# EAGLE design Power Distribution Board (EAGLE 6.6.0)
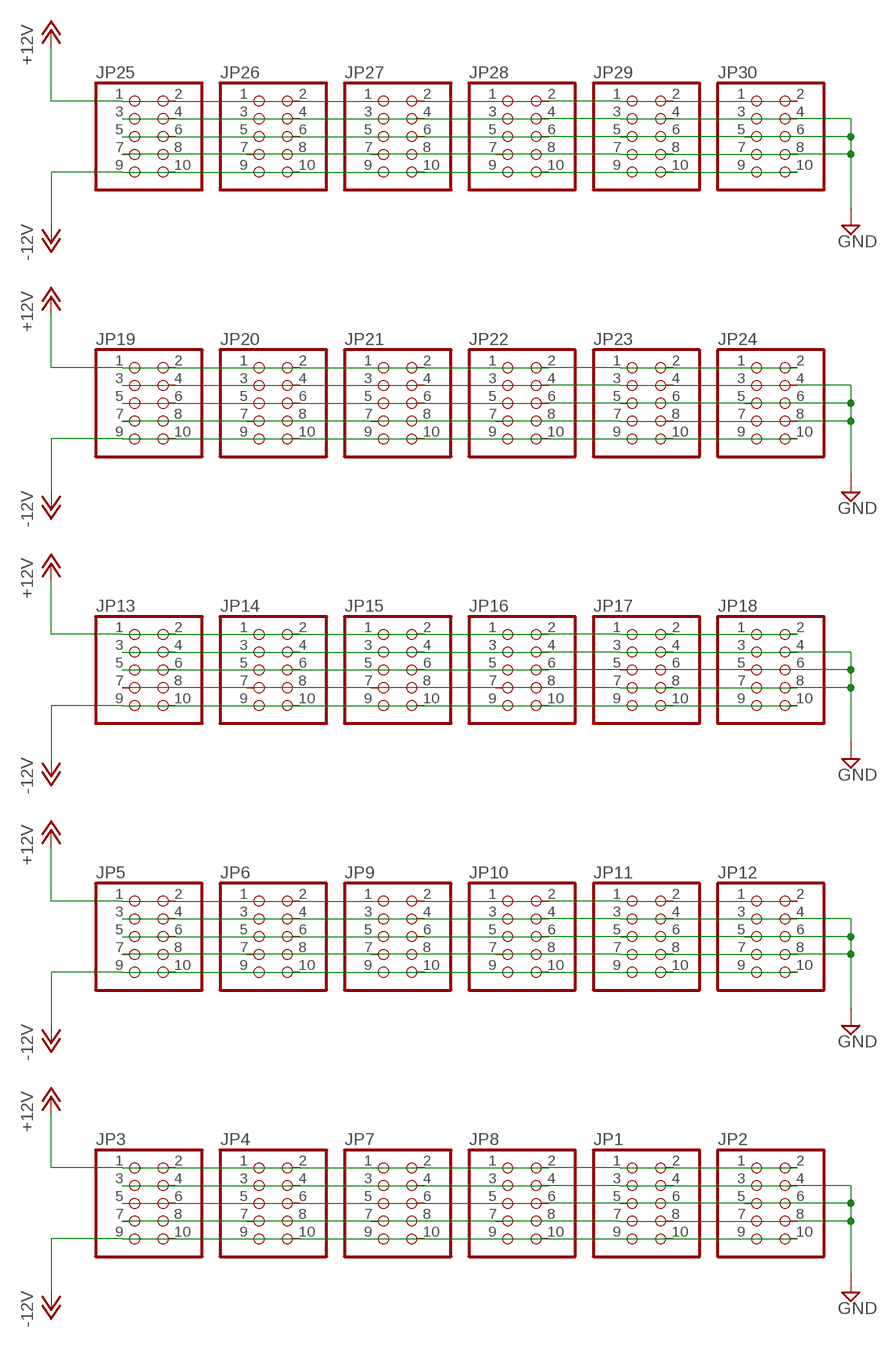
[diagram p0: schematic, sheet 1]

## Parts
JP1  PINHD-2X5  [2X05]
JP2  PINHD-2X5  [2X05]
JP3  PINHD-2X5  [2X05]
JP4  PINHD-2X5  [2X05]
JP5  PINHD-2X5  [2X05]
JP6  PINHD-2X5  [2X05]
JP7  PINHD-2X5  [2X05]
JP8  PINHD-2X5  [2X05]
JP9  PINHD-2X5  [2X05]
JP10  PINHD-2X5  [2X05]
JP11  PINHD-2X5  [2X05]
JP12  PINHD-2X5  [2X05]
JP13  PINHD-2X5  [2X05]
JP14  PINHD-2X5  [2X05]
JP15  PINHD-2X5  [2X05]
JP16  PINHD-2X5  [2X05]
JP17  PINHD-2X5  [2X05]
JP18  PINHD-2X5  [2X05]
JP19  PINHD-2X5  [2X05]
JP20  PINHD-2X5  [2X05]
JP21  PINHD-2X5  [2X05]
JP22  PINHD-2X5  [2X05]
JP23  PINHD-2X5  [2X05]
JP24  PINHD-2X5  [2X05]
JP25  PINHD-2X5  [2X05]
JP26  PINHD-2X5  [2X05]
JP27  PINHD-2X5  [2X05]
JP28  PINHD-2X5  [2X05]
JP29  PINHD-2X5  [2X05]
JP30  PINHD-2X5  [2X05]

## Nets
+12V: JP1.1 JP1.2 JP2.1 JP2.2 JP3.1 JP3.2 JP4.1 JP4.2 JP5.1 JP5.2 JP6.1 JP6.2 JP7.1 JP7.2 JP8.1 JP8.2 JP9.1 JP9.2 JP10.1 JP10.2 JP11.1 JP11.2 JP12.1 JP12.2 JP13.1 JP13.2 JP14.1 JP14.2 JP15.1 JP15.2 JP16.1 JP16.2 JP17.1 JP17.2 JP18.1 JP18.2 JP19.1 JP19.2 JP20.1 JP20.2 JP21.1 JP21.2 JP22.1 JP22.2 JP23.1 JP23.2 JP24.1 JP24.2 JP25.1 JP25.2 JP26.1 JP26.2 JP27.1 JP27.2 JP28.1 JP28.2 JP29.1 JP29.2 JP30.1 JP30.2
-12V: JP1.9 JP1.10 JP2.9 JP2.10 JP3.9 JP3.10 JP4.9 JP4.10 JP5.9 JP5.10 JP6.9 JP6.10 JP7.9 JP7.10 JP8.9 JP8.10 JP9.9 JP9.10 JP10.9 JP10.10 JP11.9 JP11.10 JP12.9 JP12.10 JP13.9 JP13.10 JP14.9 JP14.10 JP15.9 JP15.10 JP16.9 JP16.10 JP17.9 JP17.10 JP18.9 JP18.10 JP19.9 JP19.10 JP20.9 JP20.10 JP21.9 JP21.10 JP22.9 JP22.10 JP23.9 JP23.10 JP24.9 JP24.10 JP25.9 JP25.10 JP26.9 JP26.10 JP27.9 JP27.10 JP28.9 JP28.10 JP29.9 JP29.10 JP30.9 JP30.10
GND: JP1.3 JP1.4 JP1.5 JP1.6 JP1.7 JP1.8 JP2.3 JP2.4 JP2.5 JP2.6 JP2.7 JP2.8 JP3.3 JP3.4 JP3.5 JP3.6 JP3.7 JP3.8 JP4.3 JP4.4 JP4.5 JP4.6 JP4.7 JP4.8 JP5.3 JP5.4 JP5.5 JP5.6 JP5.7 JP5.8 JP6.3 JP6.4 JP6.5 JP6.6 JP6.7 JP6.8 JP7.3 JP7.4 JP7.5 JP7.6 JP7.7 JP7.8 JP8.3 JP8.4 JP8.5 JP8.6 JP8.7 JP8.8 JP9.3 JP9.4 JP9.5 JP9.6 JP9.7 JP9.8 JP10.3 JP10.4 JP10.5 JP10.6 JP10.7 JP10.8 JP11.3 JP11.4 JP11.5 JP11.6 JP11.7 JP11.8 JP12.3 JP12.4 JP12.5 JP12.6 JP12.7 JP12.8 JP13.3 JP13.4 JP13.5 JP13.6 JP13.7 JP13.8 JP14.3 JP14.4 JP14.5 JP14.6 JP14.7 JP14.8 JP15.3 JP15.4 JP15.5 JP15.6 JP15.7 JP15.8 JP16.3 JP16.4 JP16.5 JP16.6 JP16.7 JP16.8 JP17.3 JP17.4 JP17.5 JP17.6 JP17.7 JP17.8 JP18.3 JP18.4 JP18.5 JP18.6 JP18.7 JP18.8 JP19.3 JP19.4 JP19.5 JP19.6 JP19.7 JP19.8 JP20.3 JP20.4 JP20.5 JP20.6 JP20.7 JP20.8 JP21.3 JP21.4 JP21.5 JP21.6 JP21.7 JP21.8 JP22.3 JP22.4 JP22.5 JP22.6 JP22.7 JP22.8 JP23.3 JP23.4 JP23.5 JP23.6 JP23.7 JP23.8 JP24.3 JP24.4 JP24.5 JP24.6 JP24.7 JP24.8 JP25.3 JP25.4 JP25.5 JP25.6 JP25.7 JP25.8 JP26.3 JP26.4 JP26.5 JP26.6 JP26.7 JP26.8 JP27.3 JP27.4 JP27.5 JP27.6 JP27.7 JP27.8 JP28.3 JP28.4 JP28.5 JP28.6 JP28.7 JP28.8 JP29.3 JP29.4 JP29.5 JP29.6 JP29.7 JP29.8 JP30.3 JP30.4 JP30.5 JP30.6 JP30.7 JP30.8

## Library data of the parts
JP1-JP30 = pinhead:PINHD-2X5: PIN HEADER

## Board
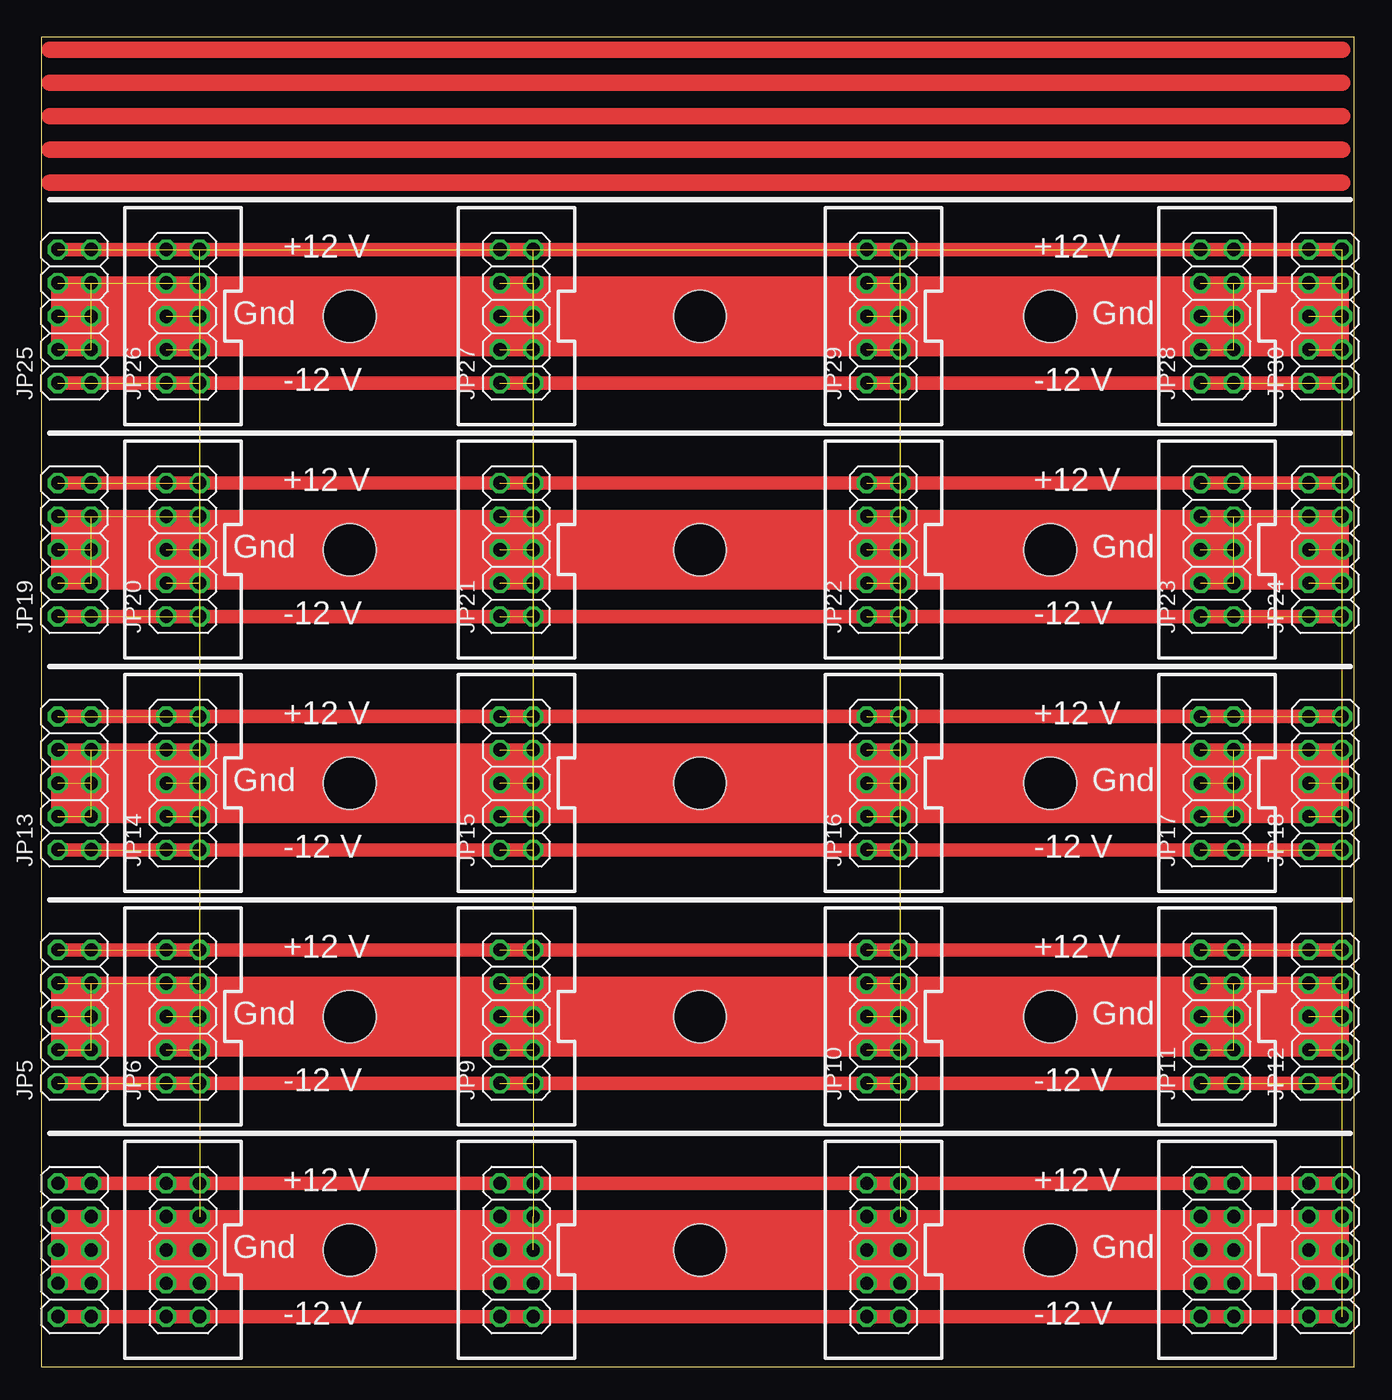
[diagram p1: board, top side]
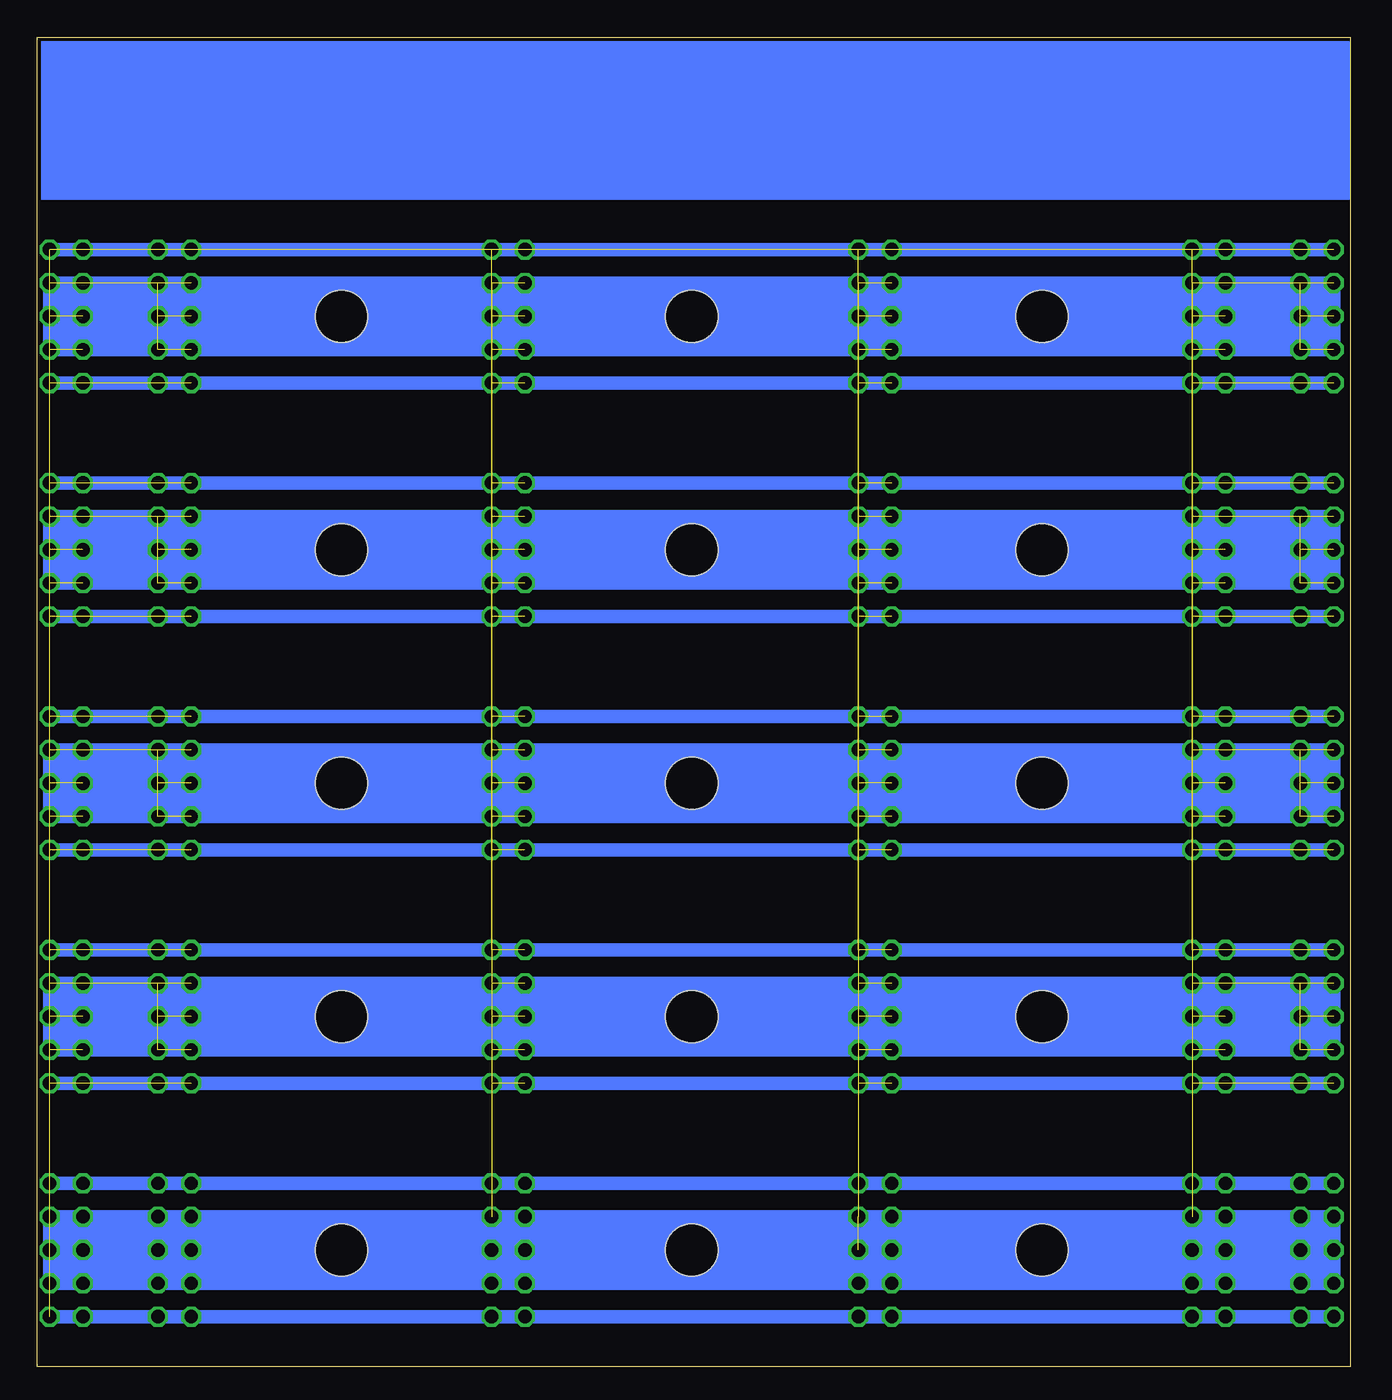
[diagram p2: board, bottom side, seen from below]

Size 100 x 101.27 mm. Coordinates in mm from the lower left corner, seen from the top.
Outline: 0,0 100,0 100,101.27 0,101.27 0,0
Copper layers (1*16): Top 0.035mm / dielectric 1.5mm / Bottom 0.035mm
Design rules "default": minimum track width 10mil, minimum drill 24mil, track to track 8mil, track to pad 8mil, pad to pad 8mil, via to via 8mil, smd to smd 8mil, copper to edge 40mil, drill to drill 8mil, minimum pad ring 10mil, minimum via ring 8mil, stop-mask expansion 4mil, vias tented up to drill 0mil, thermal gap 10mil
Holes 3.99 mm at 23.5,8.89 50.16,8.89 76.83,8.89 23.5,26.67 50.16,26.67 76.83,26.67 23.5,44.45 50.16,44.45 76.83,44.45 23.5,62.23 50.16,62.23 76.83,62.23 23.5,80.01 50.16,80.01 76.83,80.01

### Footprints (pad centres in the part's own frame; a part is rotated, then mirrored left to right if it is on the bottom)
2X05 = drill 1.016 octagon: 1 -5.08,-1.27; 2 -5.08,1.27; 3 -2.54,-1.27; 4 -2.54,1.27; 5 0,-1.27; 6 0,1.27; 7 2.54,-1.27; 8 2.54,1.27; 9 5.08,-1.27; 10 5.08,1.27

### Placement (x,y rotation side)
JP1  2.54,8.89 270 top
JP2  97.79,8.89 270 top
JP3  64.14,8.89 270 top
JP4  36.2,8.89 270 top
JP5  2.54,26.67 90 top
JP6  10.79,26.67 90 top
JP7  89.53,8.89 270 top
JP8  10.79,8.89 270 top
JP9  36.2,26.67 90 top
JP10  64.14,26.67 90 top
JP11  89.53,26.67 90 top
JP12  97.79,26.67 90 top
JP13  2.54,44.45 90 top
JP14  10.79,44.45 90 top
JP15  36.2,44.45 90 top
JP16  64.14,44.45 90 top
JP17  89.53,44.45 90 top
JP18  97.79,44.45 90 top
JP19  2.54,62.23 90 top
JP20  10.79,62.23 90 top
JP21  36.2,62.23 90 top
JP22  64.14,62.23 90 top
JP23  89.53,62.23 90 top
JP24  97.79,62.23 90 top
JP25  2.54,80.01 90 top
JP26  10.79,80.01 90 top
JP27  36.2,80.01 90 top
JP28  89.53,80.01 90 top
JP29  64.14,80.01 90 top
JP30  97.79,80.01 90 top

### Tracks (layer width: path | path; a pad name or v marks a point on that pad's centre or on a via)
+12V  (48 unrouted)
  Bottom 1.016: JP8.1 JP8.2 | JP8.1 JP4.1 JP4.2 JP3.1 JP3.2 JP7.1 JP7.2 JP2.1 JP2.2 | JP8.1 JP1.2 JP1.1
+12V1
  Top 1.016: 1.27,13.97 99.06,13.97
+12V2
  Bottom 1.016: 9.53,31.75 12.06,31.75 | 9.53,31.75 34.92,31.75 37.47,31.75 50.16,31.75 62.87,31.75 65.41,31.75 88.27,31.75 90.81,31.75 96.52,31.75 99.06,31.75 | 9.53,31.75 3.81,31.75 1.27,31.75
+12V3
  Top 1.016: 1.27,31.75 99.06,31.75
+12V4
  Bottom 1.016: 1.27,49.53 99.06,49.53
+12V5
  Top 1.016: 1.27,49.53 99.06,49.53
+12V6
  Bottom 1.016: 1.27,67.31 99.06,67.31
+12V7
  Top 1.016: 1.27,67.31 99.06,67.31
+12V8
  Bottom 1.016: 1.27,85.09 99.06,85.09
+12V9
  Top 1.016: 1.27,85.09 99.06,85.09
-12V  (48 unrouted)
  Bottom 1.016: JP1.9 JP1.10 JP8.9 JP8.10 JP4.9 JP4.10 JP3.9 JP3.10 JP7.9 JP7.10 JP2.9 JP2.10
-12V1
  Top 1.016: 1.27,3.81 99.06,3.81
-12V2
  Bottom 1.016: 1.27,21.59 3.81,21.59 9.53,21.59 12.06,21.59 34.92,21.59 37.47,21.59 50.16,21.59 62.87,21.59 65.41,21.59 88.27,21.59 90.81,21.59 96.52,21.59 99.06,21.59
-12V3
  Top 1.016: 1.27,21.59 99.06,21.59
-12V4
  Bottom 1.016: 1.27,39.37 99.06,39.37
-12V5
  Top 1.016: 1.27,39.37 99.06,39.37
-12V6
  Bottom 1.016: 1.27,57.15 99.06,57.15
-12V7
  Top 1.016: 1.27,57.15 99.06,57.15
-12V8
  Bottom 1.016: 1.27,74.93 99.06,74.93
-12V9
  Top 1.016: 1.27,74.93 99.06,74.93
GND  (145 unrouted)
  Bottom 1.016: JP1.4 JP1.3 JP1.7 JP1.8 | JP1.4 JP8.3 | JP8.3 JP8.4 | JP8.4 JP4.3 | 35.56,11.43 JP4.3 | JP4.3 JP4.4 | JP4.4 JP3.3 | JP3.3 JP3.4 | JP3.4 JP7.3 | JP7.3 JP7.4 | JP7.4 JP2.3 | JP2.3 JP2.4 JP2.6 | JP1.5 JP1.6 JP8.5 JP8.6 JP4.5 JP4.6 | JP3.5 JP3.6 JP7.5 JP7.6 JP2.5 JP2.6 | JP2.7 JP2.8 JP2.6 | JP7.8 JP2.7 | JP7.8 JP7.7 | JP3.8 JP7.7 | JP4.8 JP3.7 | JP4.8 JP4.7 | JP8.8 JP4.7 | JP8.8 JP8.7 | JP1.8 JP8.7 | JP1.8 JP1.4 | JP8.7 JP8.3 | JP8.8 JP8.4 | JP4.7 JP4.3 | JP4.8 JP4.4 | JP3.7 JP3.8 | JP3.7 JP3.3 | JP3.8 JP3.4 | JP7.7 JP7.3 | JP7.8 JP7.4 | JP2.7 JP2.3
GND1
  Top 1.016: 3.81,11.43 1.27,11.43 1.27,8.89 | 3.81,11.43 9.53,11.43 | 9.53,11.43 12.06,11.43 | 12.06,11.43 34.92,11.43 | 34.92,11.43 37.47,11.43 | 37.47,11.43 62.87,11.43 | 62.87,11.43 65.41,11.43 | 65.41,11.43 88.27,11.43 | 88.27,11.43 90.81,11.43 | 90.81,11.43 96.52,11.43 | 96.52,11.43 99.06,11.43 99.06,8.89 | 1.27,8.89 99.06,8.89 | 96.52,6.35 99.06,6.35 99.06,8.89 | 90.81,6.35 96.52,6.35 | 90.81,6.35 88.27,6.35 | 65.41,6.35 88.27,6.35 | 37.47,6.35 62.87,6.35 | 37.47,6.35 34.92,6.35 | 12.06,6.35 34.92,6.35 | 12.06,6.35 9.53,6.35 | 3.81,6.35 9.53,6.35 | 3.81,6.35 1.27,6.35 1.27,8.89 | 3.81,6.35 3.81,11.43 | 9.53,6.35 9.53,11.43 | 12.06,6.35 12.06,11.43 | 34.92,6.35 34.92,11.43 | 37.47,6.35 37.47,11.43 | 62.87,6.35 65.41,6.35 | 62.87,6.35 62.87,11.43 | 65.41,6.35 65.41,11.43 | 88.27,6.35 88.27,11.43 | 90.81,6.35 90.81,11.43 | 96.52,6.35 96.52,11.43
GND2
  Bottom 1.016: 3.81,29.21 1.27,29.21 1.27,24.13 3.81,24.13 | 3.81,29.21 9.53,29.21 | 9.53,29.21 12.06,29.21 | 12.06,29.21 34.92,29.21 | 35.56,29.21 34.92,29.21 | 34.92,29.21 37.47,29.21 | 37.47,29.21 62.87,29.21 | 62.87,29.21 65.41,29.21 | 65.41,29.21 88.27,29.21 | 88.27,29.21 90.81,29.21 | 90.81,29.21 96.52,29.21 | 96.52,29.21 99.06,29.21 99.06,26.67 | 1.27,26.67 3.81,26.67 9.53,26.67 12.06,26.67 34.92,26.67 37.47,26.67 45.09,26.67 55.24,26.67 62.87,26.67 65.41,26.67 88.27,26.67 90.81,26.67 96.52,26.67 99.06,26.67 | 96.52,24.13 99.06,24.13 99.06,26.67 | 90.81,24.13 96.52,24.13 | 90.81,24.13 88.27,24.13 | 65.41,24.13 88.27,24.13 | 37.47,24.13 62.87,24.13 | 37.47,24.13 34.92,24.13 | 12.06,24.13 34.92,24.13 | 12.06,24.13 9.53,24.13 | 3.81,24.13 9.53,24.13 | 3.81,24.13 3.81,29.21 | 9.53,24.13 9.53,29.21 | 12.06,24.13 12.06,29.21 | 34.92,24.13 34.92,29.21 | 37.47,24.13 37.47,29.21 | 62.87,24.13 65.41,24.13 | 62.87,24.13 62.87,29.21 | 65.41,24.13 65.41,29.21 | 88.27,24.13 88.27,29.21 | 90.81,24.13 90.81,29.21 | 96.52,24.13 96.52,29.21
GND3
  Top 1.016: 3.81,29.21 1.27,29.21 1.27,26.67 | 3.81,29.21 9.53,29.21 | 9.53,29.21 12.06,29.21 | 12.06,29.21 34.92,29.21 | 34.92,29.21 37.47,29.21 | 37.47,29.21 62.87,29.21 | 62.87,29.21 65.41,29.21 | 65.41,29.21 88.27,29.21 | 88.27,29.21 90.81,29.21 | 90.81,29.21 96.52,29.21 | 96.52,29.21 99.06,29.21 99.06,26.67 | 1.27,26.67 99.06,26.67 | 96.52,24.13 99.06,24.13 99.06,26.67 | 90.81,24.13 96.52,24.13 | 90.81,24.13 88.27,24.13 | 65.41,24.13 88.27,24.13 | 37.47,24.13 62.87,24.13 | 37.47,24.13 34.92,24.13 | 12.06,24.13 34.92,24.13 | 12.06,24.13 9.53,24.13 | 3.81,24.13 9.53,24.13 | 3.81,24.13 1.27,24.13 1.27,26.67 | 3.81,24.13 3.81,29.21 | 9.53,24.13 9.53,29.21 | 12.06,24.13 12.06,29.21 | 34.92,24.13 34.92,29.21 | 37.47,24.13 37.47,29.21 | 62.87,24.13 65.41,24.13 | 62.87,24.13 62.87,29.21 | 65.41,24.13 65.41,29.21 | 88.27,24.13 88.27,29.21 | 90.81,24.13 90.81,29.21 | 96.52,24.13 96.52,29.21
GND4
  Bottom 1.016: 3.81,46.99 1.27,46.99 1.27,41.91 3.81,41.91 | 3.81,46.99 9.53,46.99 | 9.53,46.99 12.06,46.99 | 12.06,46.99 34.92,46.99 | 34.92,46.99 37.47,46.99 | 37.47,46.99 62.87,46.99 | 62.87,46.99 65.41,46.99 | 65.41,46.99 88.27,46.99 | 88.27,46.99 90.81,46.99 | 90.81,46.99 96.52,46.99 | 96.52,46.99 99.06,46.99 99.06,44.45 | 1.27,44.45 99.06,44.45 | 96.52,41.91 99.06,41.91 99.06,44.45 | 90.81,41.91 96.52,41.91 | 90.81,41.91 88.27,41.91 | 65.41,41.91 88.27,41.91 | 37.47,41.91 62.87,41.91 | 37.47,41.91 34.92,41.91 | 12.06,41.91 34.92,41.91 | 12.06,41.91 9.53,41.91 | 3.81,41.91 9.53,41.91 | 3.81,41.91 3.81,46.99 | 9.53,41.91 9.53,46.99 | 12.06,41.91 12.06,46.99 | 34.92,41.91 34.92,46.99 | 37.47,41.91 37.47,46.99 | 62.87,41.91 65.41,41.91 | 62.87,41.91 62.87,46.99 | 65.41,41.91 65.41,46.99 | 88.27,41.91 88.27,46.99 | 90.81,41.91 90.81,46.99 | 96.52,41.91 96.52,46.99
GND5
  Top 1.016: 3.81,46.99 1.27,46.99 1.27,44.45 | 3.81,46.99 9.53,46.99 | 9.53,46.99 12.06,46.99 | 12.06,46.99 34.92,46.99 | 34.92,46.99 37.47,46.99 | 37.47,46.99 62.87,46.99 | 62.87,46.99 65.41,46.99 | 65.41,46.99 88.27,46.99 | 88.27,46.99 90.81,46.99 | 90.81,46.99 96.52,46.99 | 96.52,46.99 99.06,46.99 99.06,44.45 | 1.27,44.45 99.06,44.45 | 96.52,41.91 99.06,41.91 99.06,44.45 | 90.81,41.91 96.52,41.91 | 90.81,41.91 88.27,41.91 | 65.41,41.91 88.27,41.91 | 37.47,41.91 62.87,41.91 | 37.47,41.91 34.92,41.91 | 12.06,41.91 34.92,41.91 | 12.06,41.91 9.53,41.91 | 3.81,41.91 9.53,41.91 | 3.81,41.91 1.27,41.91 1.27,44.45 | 3.81,41.91 3.81,46.99 | 9.53,41.91 9.53,46.99 | 12.06,41.91 12.06,46.99 | 34.92,41.91 34.92,46.99 | 37.47,41.91 37.47,46.99 | 62.87,41.91 65.41,41.91 | 62.87,41.91 62.87,46.99 | 65.41,41.91 65.41,46.99 | 88.27,41.91 88.27,46.99 | 90.81,41.91 90.81,46.99 | 96.52,41.91 96.52,46.99
GND6
  Bottom 1.016: 3.81,64.77 1.27,64.77 1.27,59.69 3.81,59.69 | 3.81,64.77 9.53,64.77 | 9.53,64.77 12.06,64.77 | 12.06,64.77 34.92,64.77 | 34.92,64.77 37.47,64.77 | 37.47,64.77 62.87,64.77 | 62.87,64.77 65.41,64.77 | 65.41,64.77 88.27,64.77 | 88.27,64.77 90.81,64.77 | 90.81,64.77 96.52,64.77 | 96.52,64.77 99.06,64.77 99.06,62.23 | 1.27,62.23 99.06,62.23 | 96.52,59.69 99.06,59.69 99.06,62.23 | 90.81,59.69 96.52,59.69 | 90.81,59.69 88.27,59.69 | 65.41,59.69 88.27,59.69 | 37.47,59.69 62.87,59.69 | 37.47,59.69 34.92,59.69 | 12.06,59.69 34.92,59.69 | 12.06,59.69 9.53,59.69 | 3.81,59.69 9.53,59.69 | 3.81,59.69 3.81,64.77 | 9.53,59.69 9.53,64.77 | 12.06,59.69 12.06,64.77 | 34.92,59.69 34.92,64.77 | 37.47,59.69 37.47,64.77 | 62.87,59.69 65.41,59.69 | 62.87,59.69 62.87,64.77 | 65.41,59.69 65.41,64.77 | 88.27,59.69 88.27,64.77 | 90.81,59.69 90.81,64.77 | 96.52,59.69 96.52,64.77
GND7
  Top 1.016: 3.81,64.77 1.27,64.77 1.27,62.23 | 3.81,64.77 9.53,64.77 | 9.53,64.77 12.06,64.77 | 12.06,64.77 34.92,64.77 | 34.92,64.77 37.47,64.77 | 37.47,64.77 62.87,64.77 | 62.87,64.77 65.41,64.77 | 65.41,64.77 88.27,64.77 | 88.27,64.77 90.81,64.77 | 90.81,64.77 96.52,64.77 | 96.52,64.77 99.06,64.77 99.06,62.23 | 1.27,62.23 99.06,62.23 | 96.52,59.69 99.06,59.69 99.06,62.23 | 90.81,59.69 96.52,59.69 | 90.81,59.69 88.27,59.69 | 65.41,59.69 88.27,59.69 | 37.47,59.69 62.87,59.69 | 37.47,59.69 34.92,59.69 | 12.06,59.69 34.92,59.69 | 12.06,59.69 9.53,59.69 | 3.81,59.69 9.53,59.69 | 3.81,59.69 1.27,59.69 1.27,62.23 | 3.81,59.69 3.81,64.77 | 9.53,59.69 9.53,64.77 | 12.06,59.69 12.06,64.77 | 34.92,59.69 34.92,64.77 | 37.47,59.69 37.47,64.77 | 62.87,59.69 65.41,59.69 | 62.87,59.69 62.87,64.77 | 65.41,59.69 65.41,64.77 | 88.27,59.69 88.27,64.77 | 90.81,59.69 90.81,64.77 | 96.52,59.69 96.52,64.77
GND8
  Bottom 1.016: 3.81,82.55 1.27,82.55 1.27,77.47 3.81,77.47 | 3.81,82.55 9.53,82.55 | 9.53,82.55 12.06,82.55 | 12.06,82.55 34.92,82.55 | 34.92,82.55 37.47,82.55 | 37.47,82.55 62.87,82.55 | 62.87,82.55 65.41,82.55 | 65.41,82.55 88.27,82.55 | 88.27,82.55 90.81,82.55 | 90.81,82.55 96.52,82.55 | 96.52,82.55 99.06,82.55 99.06,80.01 | 1.27,80.01 99.06,80.01 | 96.52,77.47 99.06,77.47 99.06,80.01 | 90.81,77.47 96.52,77.47 | 90.81,77.47 88.27,77.47 | 65.41,77.47 88.27,77.47 | 37.47,77.47 62.87,77.47 | 37.47,77.47 34.92,77.47 | 12.06,77.47 34.92,77.47 | 12.06,77.47 9.53,77.47 | 3.81,77.47 9.53,77.47 | 3.81,77.47 3.81,82.55 | 9.53,77.47 9.53,82.55 | 12.06,77.47 12.06,82.55 | 34.92,77.47 34.92,82.55 | 37.47,77.47 37.47,82.55 | 62.87,77.47 65.41,77.47 | 62.87,77.47 62.87,82.55 | 65.41,77.47 65.41,82.55 | 88.27,77.47 88.27,82.55 | 90.81,77.47 90.81,82.55 | 96.52,77.47 96.52,82.55
GND9
  Top 1.016: 3.81,82.55 1.27,82.55 1.27,80.01 | 3.81,82.55 9.53,82.55 | 9.53,82.55 12.06,82.55 | 12.06,82.55 34.92,82.55 | 34.92,82.55 37.47,82.55 | 37.47,82.55 62.87,82.55 | 62.87,82.55 65.41,82.55 | 65.41,82.55 88.27,82.55 | 88.27,82.55 90.81,82.55 | 90.81,82.55 96.52,82.55 | 96.52,82.55 99.06,82.55 99.06,80.01 | 1.27,80.01 99.06,80.01 | 96.52,77.47 99.06,77.47 99.06,80.01 | 90.81,77.47 96.52,77.47 | 90.81,77.47 88.27,77.47 | 65.41,77.47 88.27,77.47 | 37.47,77.47 62.87,77.47 | 37.47,77.47 34.92,77.47 | 12.06,77.47 34.92,77.47 | 12.06,77.47 9.53,77.47 | 3.81,77.47 9.53,77.47 | 3.81,77.47 1.27,77.47 1.27,80.01 | 3.81,77.47 3.81,82.55 | 9.53,77.47 9.53,82.55 | 12.06,77.47 12.06,82.55 | 34.92,77.47 34.92,82.55 | 37.47,77.47 37.47,82.55 | 62.87,77.47 65.41,77.47 | 62.87,77.47 62.87,82.55 | 65.41,77.47 65.41,82.55 | 88.27,77.47 88.27,82.55 | 90.81,77.47 90.81,82.55 | 96.52,77.47 96.52,82.55
N$1
  Top 1.27: 0.64,100.33 99.06,100.33 | 0.64,97.79 99.06,97.79 | 0.64,95.25 99.06,95.25 | 0.64,92.71 99.06,92.71 | 0.64,90.17 99.06,90.17
(copper drawn outside any net)
  shapes: Bottom area x6, Top area x5

### Text on the board
tPlace: +12 V | +12 V | Gnd | Gnd | -12 V | -12 V | +12 V | +12 V | Gnd | Gnd | -12 V | -12 V | +12 V | +12 V | Gnd | Gnd | -12 V | -12 V | +12 V | +12 V | Gnd | Gnd | -12 V | -12 V | +12 V | +12 V | Gnd | Gnd | -12 V | -12 V